# EAGLE design Final project combined (EAGLE 7.6.0)
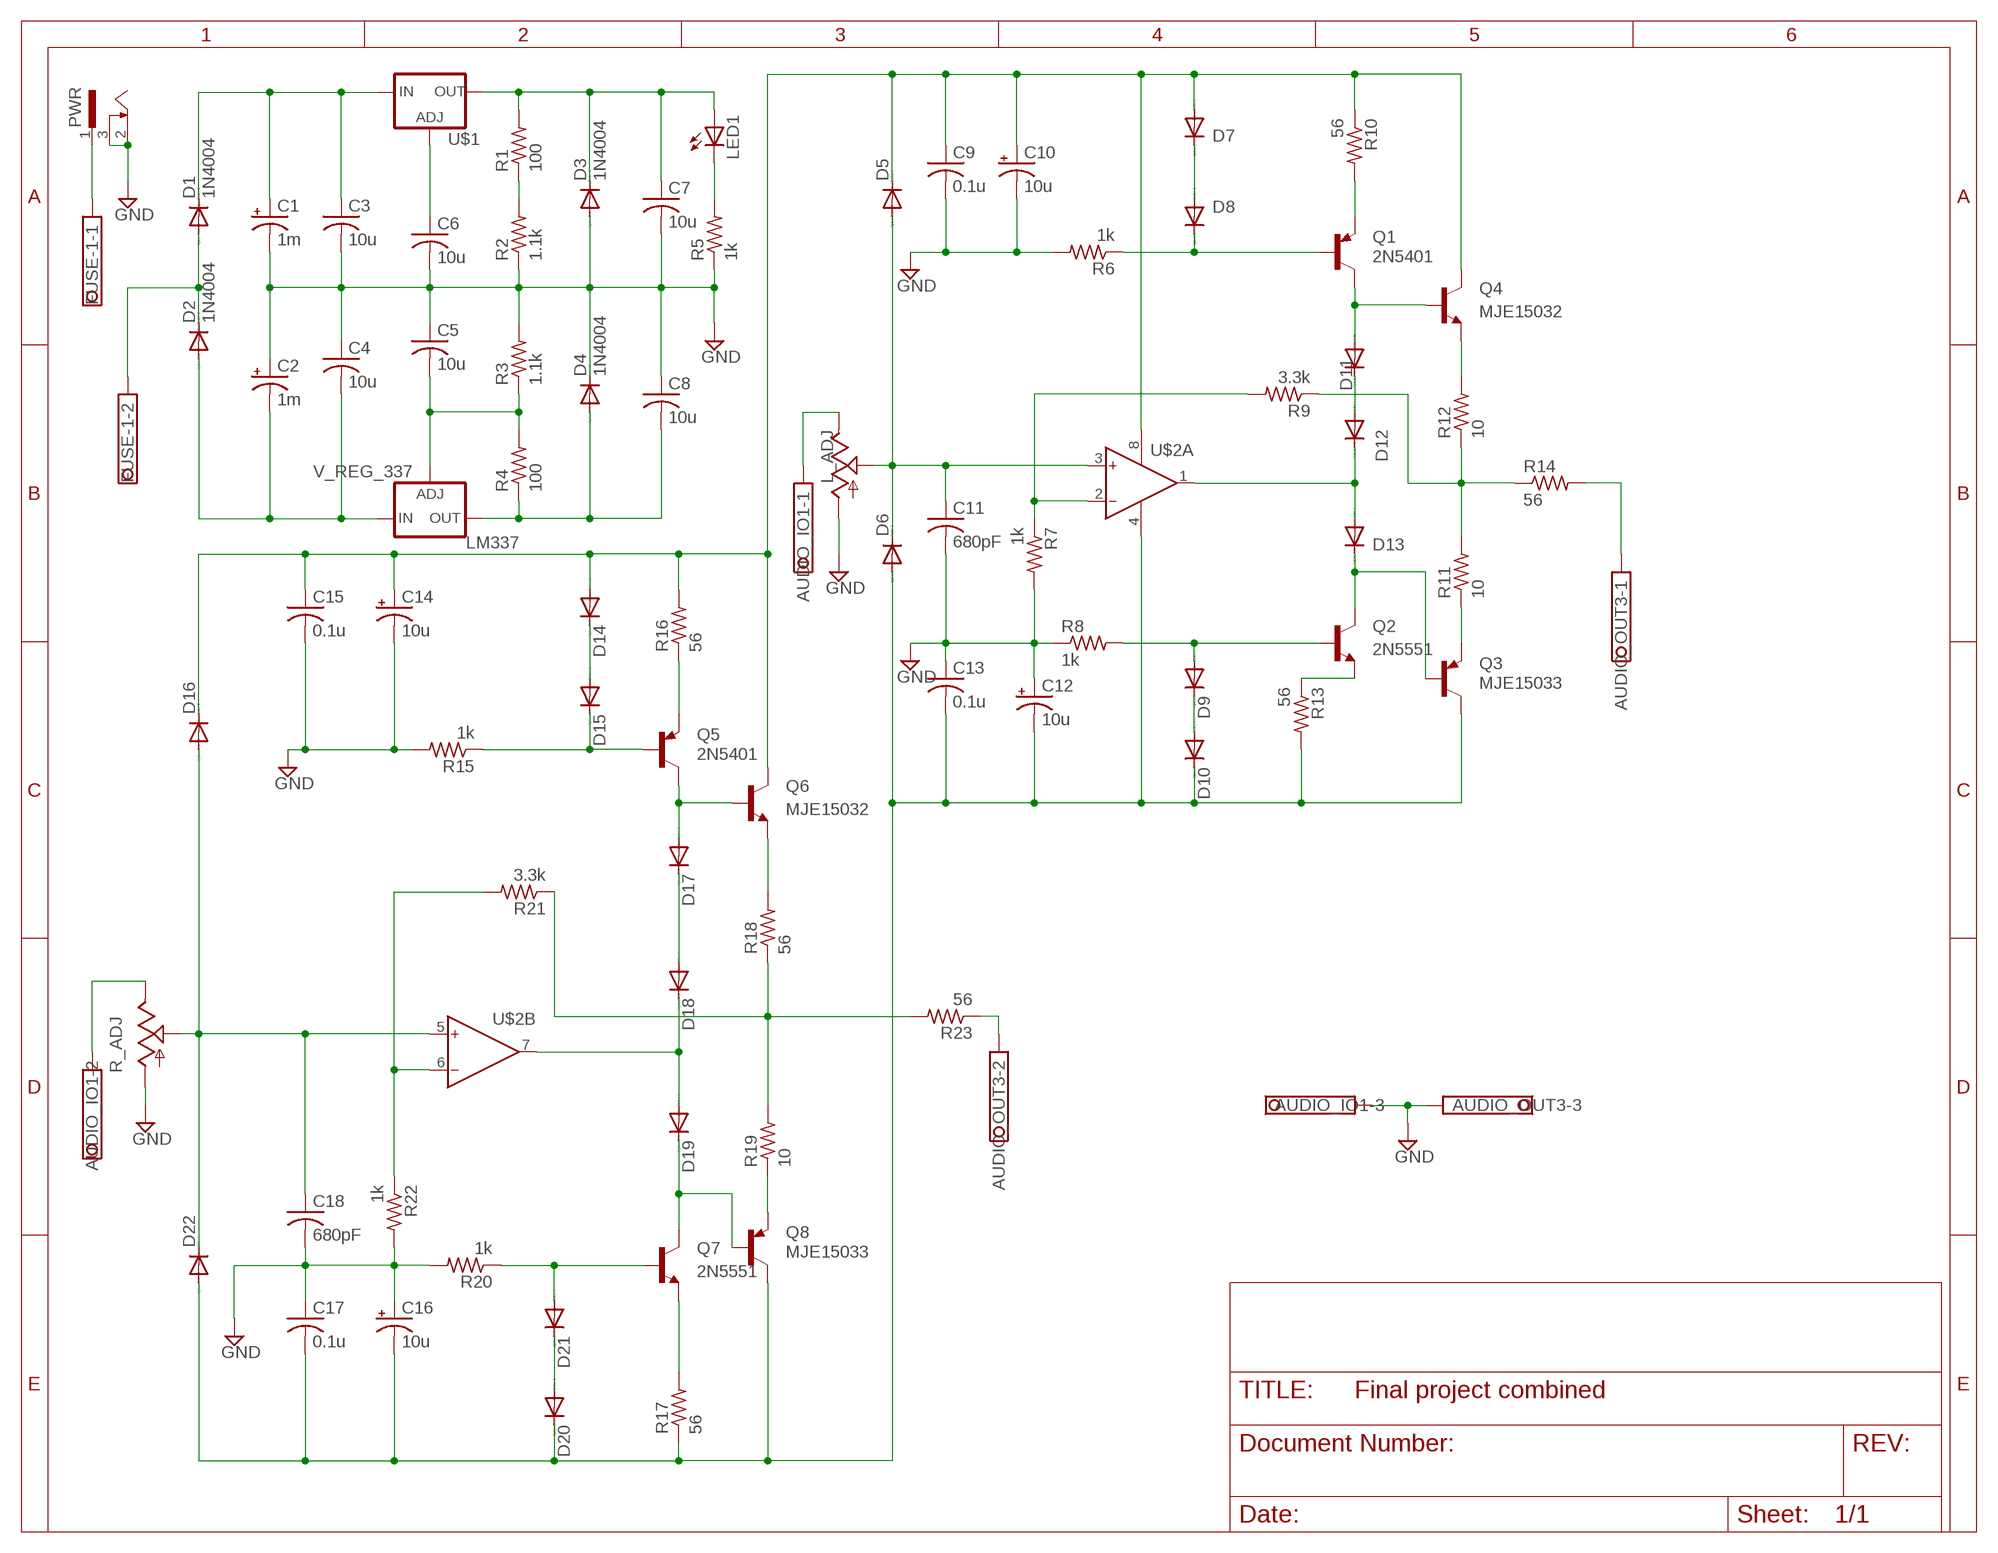
[diagram p0: schematic, sheet 1]

## Parts
AUDIO_IO1  1751251  [1751251]
AUDIO_OUT3  1751251  [1751251]
C1  1m  CPOL-USE2-5  [E2-5]
C2  1m  CPOL-USE2-5  [E2-5]
C3  10u  C-US025-024X044  [C025-024X044]
C4  10u  C-US025-024X044  [C025-024X044]
C5  10u  C-US025-024X044  [C025-024X044]
C6  10u  C-US025-024X044  [C025-024X044]
C7  10u  C-US025-024X044  [C025-024X044]
C8  10u  C-US025-024X044  [C025-024X044]
C9  0.1u  C-US025-024X044  [C025-024X044]
C10  10u  CPOL-USE2-5  [E2-5]
C11  680pF  C-US025-024X044  [C025-024X044]
C12  10u  CPOL-USE2-5  [E2-5]
C13  0.1u  C-US025-024X044  [C025-024X044]
C14  10u  CPOL-USE2-5  [E2-5]
C15  0.1u  C-US025-024X044  [C025-024X044]
C16  10u  CPOL-USE2-5  [E2-5]
C17  0.1u  C-US025-024X044  [C025-024X044]
C18  680pF  C-US025-024X044  [C025-024X044]
D1  1N4004  [DO41-10]
D2  1N4004  [DO41-10]
D3  1N4004  [DO41-10]
D4  1N4004  [DO41-10]
D5  1N4148DO35-7  [DO35-7]
D6  1N4148DO35-7  [DO35-7]
D7  1N4148DO35-7  [DO35-7]
D8  1N4148DO35-7  [DO35-7]
D9  1N4148DO35-7  [DO35-7]
D10  1N4148DO35-7  [DO35-7]
D11  1N4148DO35-7  [DO35-7]
D12  1N4148DO35-7  [DO35-7]
D13  1N4148DO35-7  [DO35-7]
D14  1N4004  [DO41-10]
D15  1N4004  [DO41-10]
D16  1N4004  [DO41-10]
D17  1N4004  [DO41-10]
D18  1N4004  [DO41-10]
D19  1N4004  [DO41-10]
D20  1N4004  [DO41-10]
D21  1N4004  [DO41-10]
D22  1N4004  [DO41-10]
FUSE-1  1751248  [1751248]
L_ADJ  TRIM_US-B64Y  [B64Y]
LED1  LED5MM  [LED5MM]
LM337  V_REG_337  [TO220-ADJ-NEG]
PWR  SCD-014A  [SCD-014-A]
Q1  2N5401  [2N5401]
Q2  2N5551  [2N5551]
Q3  MJE15033  [TO220V]
Q4  MJE15032  [TO220V]
Q5  2N5401  [2N5401]
Q6  MJE15032  [TO220V]
Q7  2N5551  [2N5551]
Q8  MJE15033  [TO220V]
R1  100  R-US_0207/15  [0207/15]
R2  1.1k  R-US_0207/15  [0207/15]
R3  1.1k  R-US_0207/15  [0207/15]
R4  100  R-US_0207/15  [0207/15]
R5  1k  R-US_0207/15  [0207/15]
R6  1k  R-US_0207/15  [0207/15]
R7  1k  R-US_0207/15  [0207/15]
R8  1k  R-US_0207/15  [0207/15]
R9  3.3k  R-US_0207/15  [0207/15]
R10  56  R-US_0207/15  [0207/15]
R11  10  R-US_0207/15  [0207/15]
R12  10  R-US_0207/15  [0207/15]
R13  56  R-US_0207/15  [0207/15]
R14  56  R-US_0207/15  [0207/15]
R15  1k  R-US_0207/15  [0207/15]
R16  56  R-US_0207/15  [0207/15]
R17  56  R-US_0207/15  [0207/15]
R18  56  R-US_0207/15  [0207/15]
R19  10  R-US_0207/15  [0207/15]
R20  1k  R-US_0207/15  [0207/15]
R21  3.3k  R-US_0207/15  [0207/15]
R22  1k  R-US_0207/15  [0207/15]
R23  56  R-US_0207/15  [0207/15]
R_ADJ  TRIM_US-B64Y  [B64Y]
U$1  V_REG_317SINK  [TO220-ADJ]
U$2  OP275'P'  [DIL08]

## Nets
GND: AUDIO_IO1.3 AUDIO_OUT3.3 C1.- C2.+ C3.2 C4.1 C5.1 C6.2 C7.2 C8.1 C9.2 C10.- C11.2 C12.+ C13.1 C14.- C15.2 C16.+ C17.1 C18.2 D3.A D4.C L_ADJ.A PWR.2 PWR.3 R2.1 R3.2 R5.1 R6.2 R7.2 R8.1 R15.2 R20.2 R22.2 R_ADJ.A
N$1: D7.C D8.A
N$2: R1.1 R2.2
N$3: C11.1 D5.A D6.C L_ADJ.S U$2.3(A:IN+)
N$4: D11.A Q1.C Q4.1(B)
N$5: C9.1 C10.+ C14.+ C15.1 D5.C D7.A D14.A D16.C Q4.2(C) Q6.2(C) R10.1 R16.2 U$2.8(PWR:V+)
N$6: D11.C D12.A
N$7: D1.A D2.C FUSE-1.2
N$8: D17.A Q5.C Q6.1(B)
N$9: C2.- C4.2 D2.A LM337.IN
N$10: C1.+ C3.1 D1.C U$1.IN
N$11: D8.C Q1.B R6.1
N$12: R7.1 R9.2 U$2.2(A:IN-)
N$13: D9.A Q2.B R8.2
N$14: D9.C D10.A
N$15: Q2.E R13.1
N$16: D13.C Q2.C Q3.1(B)
N$17: D12.C D13.A U$2.1(A:OUT)
N$18: R9.1 R11.2 R12.1 R14.1
N$19: Q3.3(E) R11.1
N$20: Q4.3(E) R12.2
N$21: C6.1 U$1.ADJ
N$22: Q1.E R10.2
N$23: FUSE-1.1 PWR.1
N$24: D14.C D15.A
N$25: D15.C Q5.B R15.1
N$26: Q5.E R16.1
N$27: Q6.3(E) R18.2
N$28: D17.C D18.A
N$29: Q8.3(E) R19.1
N$30: D19.C Q7.C Q8.1(B)
N$31: D18.C D19.A U$2.7(B:OUT)
N$32: D21.A Q7.B R20.1
N$33: D20.A D21.C
N$34: R18.1 R19.2 R21.1 R23.2
N$35: R21.2 R22.1 U$2.6(B:IN-)
N$36: C18.1 D16.A D22.C R_ADJ.S U$2.5(B:IN+)
N$37: Q7.E R17.2
N$38: AUDIO_IO1.2 R_ADJ.E
N$39: C12.- C13.2 C16.- C17.2 D6.A D10.C D20.C D22.A Q3.2(C) Q8.2(C) R13.2 R17.1 U$2.4(PWR:V-)
N$40: AUDIO_IO1.1 L_ADJ.E
N$41: C8.2 D4.A LM337.OUT R4.1
N$42: C5.2 LM337.ADJ R3.1 R4.2
N$43: LED1.K(C) R5.2
N$44: C7.1 D3.C LED1.A R1.2 U$1.OUT
N$45: AUDIO_OUT3.2 R23.1
N$46: AUDIO_OUT3.1 R14.2

## Library data of the parts
AUDIO_IO1 AUDIO_OUT3 = con-phoenix-350:1751251: MKDS 1/ 3-3,5 Printklemme Nennstrom: 10 A Bemessungsspannung: 160 V Raster: 3,5 mm Polzahl: 3 Montageart: Löten Anschlussart: Schraubanschluss Anschlussrichtung vom Leiter zur Platine: 0° Source: http://eshop.phoenixcontact.com .. 1751251.pdf; OC_FARNELL: unknown; OC_NEWARK: unknown
C1 C2 C10 C12 C14 C16 = rcl:CPOL-US: POLARIZED CAPACITOR, American symbol
C3-C9 C11 C13 C15 C17 C18 = rcl:C-US: CAPACITOR, American symbol
D1-D4 D14-D22 = diode:1N4004: DIODE general purpose rectifier, 1 A
D5-D13 = diode:1N4148: DIODE high speed (Philips)
FUSE-1 = con-phoenix-350:1751248: MKDS 1/ 2-3,5 Printklemme Nennstrom: 10 A Bemessungsspannung: 160 V Raster: 3,5 mm Polzahl: 2 Montageart: Löten Anschlussart: Schraubanschluss Anschlussrichtung vom Leiter zur Platine: 0° Source: http://eshop.phoenixcontact.com .. 1751248.pdf; OC_FARNELL: unknown; OC_NEWARK: unknown
L_ADJ R_ADJ = pot:TRIM_US-: POTENTIOMETER
LED1 = led:LED: LED OSRAM: - CHIPLED LG R971, LG N971, LY N971, LG Q971, LY Q971, LO R971, LY R971 LH N974, LH R974 LS Q976, LO Q976, LY Q976 LO Q996 - Hyper CHIPLED LW Q18S LB Q993, LB Q99A, LB R99A - SideLED LS A670, LO A670, LY A670, LG A670, LP A670 LB A673, LV A673, LT A673, LW A673 LH A674 LY A675 LS A676, LA A676, LO A676, LY A676, LW A676 LS A679, LY A679, LG A679 - Hyper Micro SIDELED® LS Y876, LA Y876, LO Y876, LY Y876 LT Y87S - SmartLED LW L88C, LW L88S LB L89C, LB L89S, LG L890 LS L89K, LO L89K, LY L89K LS L896, LA L896, LO L896, LY L896 - TOPLED LS T670, LO T670, LY T670, LG T670, LP T670 LSG T670, LSP T670, LSY T670, LOP T670, LYG T670 LG T671, LOG T671, LSG T671 LB T673, LV T673, LT T673, LW T673 LH T674 LS T676, LA T676, LO T676, LY T676, LB T676, LH T676, LSB T676, LW T676 LB T67C, LV T67C, LT T67C, LS T67K, LO T67K, LY T67K, LW E67C LS E67B, LA E67B, LO E67B, LY E67B, LB E67C, LV E67C, LT E67C LW T67C LS T679, LY T679, LG T679 LS T770, LO T770, LY T770, LG T770, LP T770 LB T773, LV T773, LT T773, LW T773 LH T774 LS E675, LA E675, LY E675, LS T675 LS T776, LA T776, LO T776, LY T776, LB T776 LHGB T686 LT T68C, LB T68C - Hyper Mini TOPLED® LB M676 - Mini TOPLED Santana® LG M470 LS M47K, LO M47K, LY M47K Source: http://www.osram.convergy.de LUXEON: - LUMILED® LXK2-PW12-R00, LXK2-PW12-S00, LXK2-PW14-U00, LXK2-PW14-V00 LXK2-PM12-R00, LXK2-PM12-S00, LXK2-PM14-U00 LXK2-PE12-Q00, LXK2-PE12-R00, LXK2-PE12-S00, LXK2-PE14-T00, LXK2-PE14-U00 LXK2-PB12-K00, LXK2-PB12-L00, LXK2-PB12-M00, LXK2-PB14-N00, LXK2-PB14-P00, LXK2-PB14-Q00 LXK2-PR12-L00, LXK2-PR12-M00, LXK2-PR14-Q00, LXK2-PR14-R00 LXK2-PD12-Q00, LXK2-PD12-R00, LXK2-PD12-S00 LXK2-PH12-R00, LXK2-PH12-S00 LXK2-PL12-P00, LXK2-PL12-Q00, LXK2-PL12-R00 Source: www.luxeon.com KINGBRIGHT: KA-3528ASYC Source: www.kingbright.com
LM337 = engr301_lib:V_REG_337: LM-337 Negative Adjustable Voltage Regulator
PWR = con-shiua-chyuan:SCD-014A: Power Jack 2.5mm; OC_FARNELL: unknown; OC_NEWARK: unknown
Q1 Q5 = engr301_lib:2N5401
Q2 Q7 = engr301_lib:2N5551
Q3 Q8 = engr301_lib:MJE15033: PNP Power Transistor HF Audio Driver 8.0A, 250V, 50W
Q4 Q6 = engr301_lib:MJE15032: NPN Power Transistor HF Audio Driver 8.0A, 250V, 50W
R1-R23 = rcl:R-US_: RESISTOR, American symbol
U$1 = engr301_lib:V_REG_317: Voltage Regulator Standard LM317 adjustable voltage regulator. AOI (Adjust Output Input). Google 'LM317 Calculator' for easy to use app to get the two resistor values needed. 240/720 for 5V output. 240/390 for 3.3V output. Spark Fun Electronics SKU : COM-00527
U$2 = engr301_lib:OP275: OP275 - Dual Bipolar/JFET Audio Op-amp

## Board
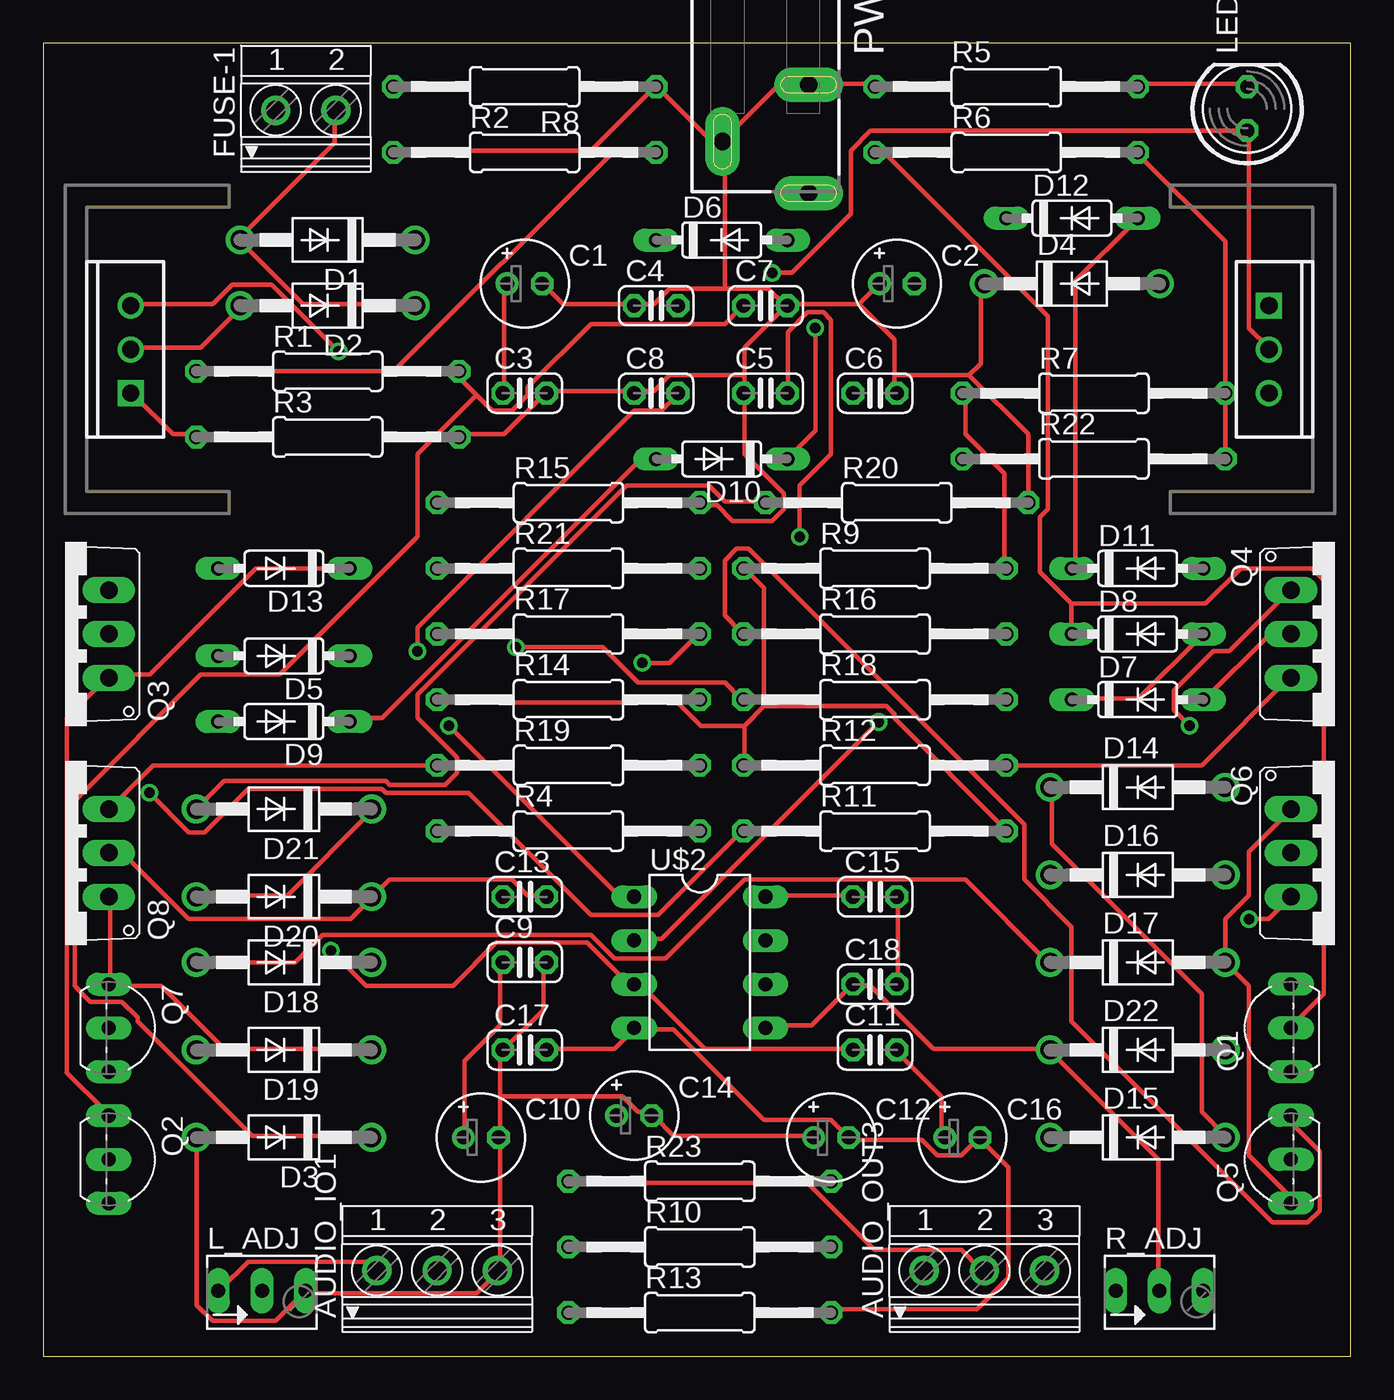
[diagram p1: board, top side]
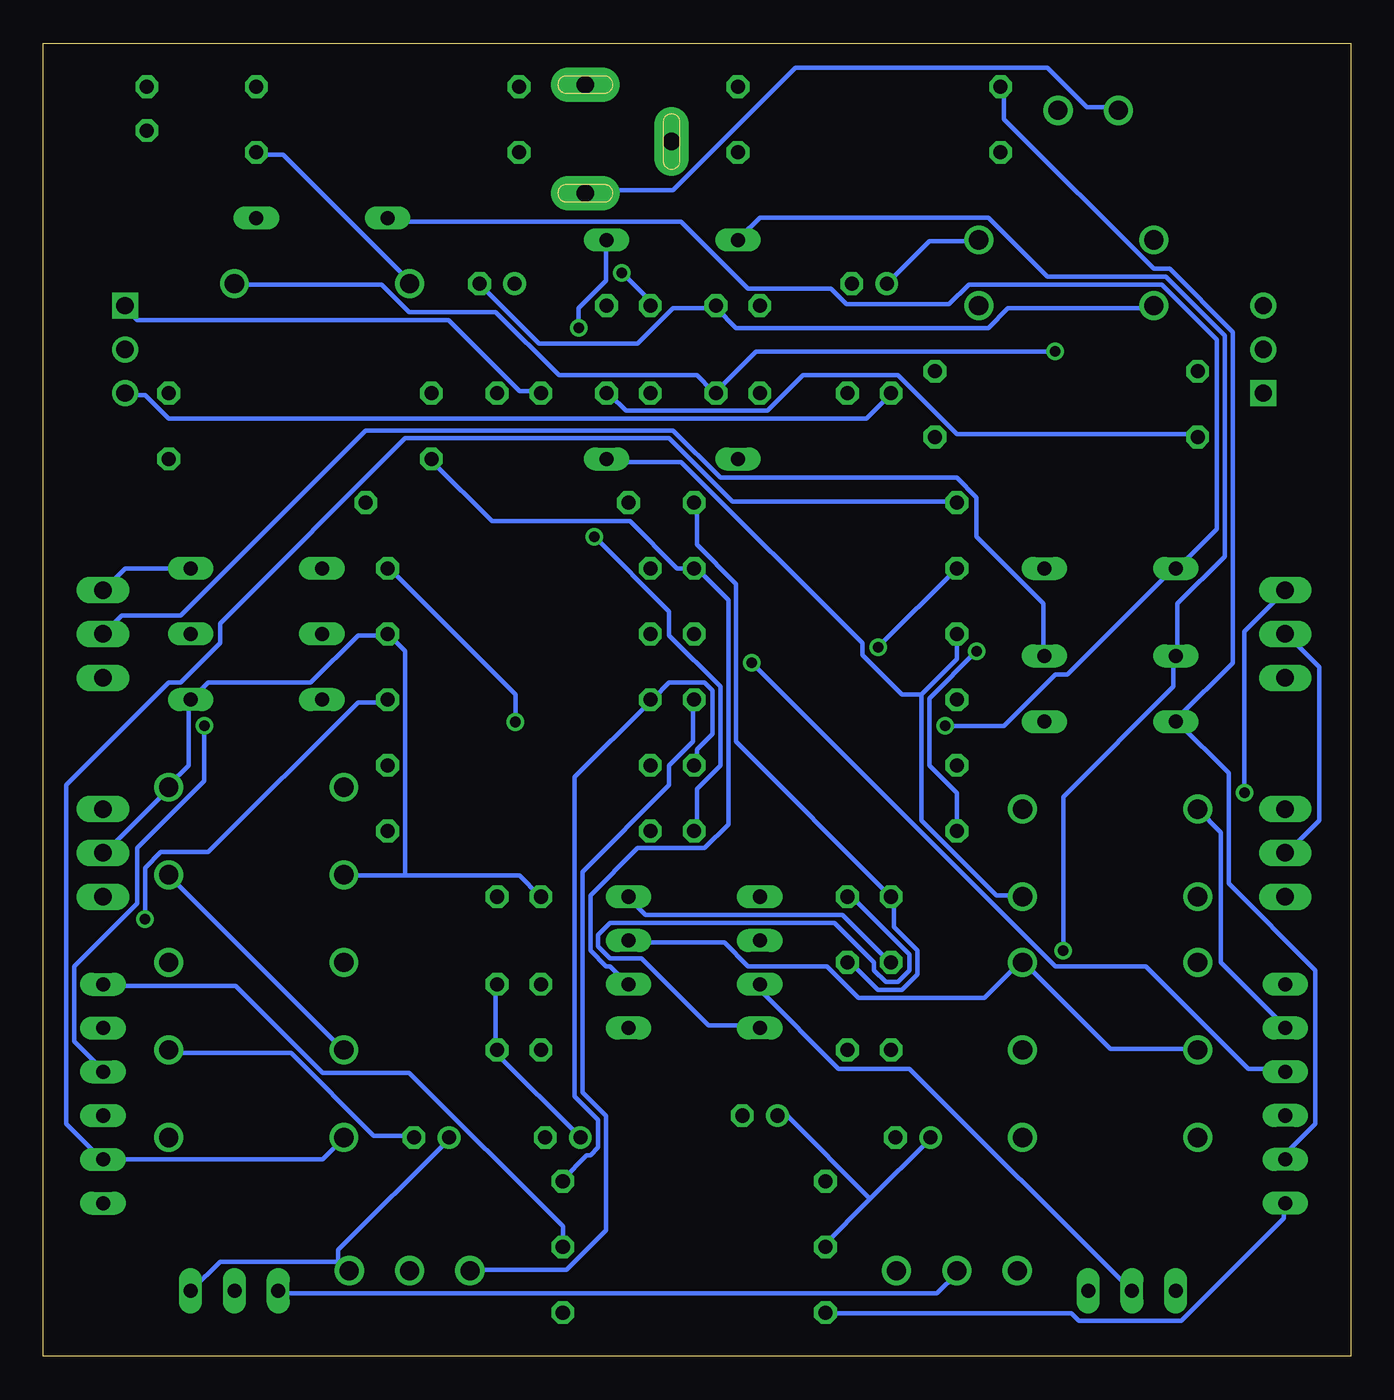
[diagram p2: board, bottom side, seen from below]

Size 75.87 x 76.19 mm. Coordinates in mm from the lower left corner, seen from the top.
Outline: 0,0 75.87,0 75.87,76.19 0,76.19 0,0
Copper layers (1*16): Top 0.035mm / dielectric 1.5mm / Bottom 0.035mm
Design rules "default": minimum track width 10mil, minimum drill 24mil, track to track 8mil, track to pad 8mil, pad to pad 8mil, via to via 8mil, smd to smd 8mil, copper to edge 40mil, drill to drill 8mil, minimum pad ring 10mil, minimum via ring 8mil, stop-mask expansion 4mil, vias tented up to drill 0mil, thermal gap 10mil

### Footprints (pad centres in the part's own frame; a part is rotated, then mirrored left to right if it is on the bottom)
1751251 = drill 1.1 pad 1.7: 1 -3.5,-0.1; 2 0,-0.1; 3 3.5,-0.1
E2-5 = drill 0.813 pad 1.27: + -1.016,0 | drill 0.813 pad 1.27 octagon: - 1.016,0
C025-024X044 = drill 0.813 octagon: 1 -1.27,0; 2 1.27,0
DO41-10 = drill 1.118: A 5.08,0; C -5.08,0
DO35-7 = drill 0.813 long: A 3.81,0; C -3.81,0
1751248 = drill 1.1 pad 1.7: 1 -1.75,-0.1; 2 1.75,-0.1
B64Y = drill 0.813 long: A 2.54,0; E -2.54,0; S 0,0
LED5MM = drill 0.813 octagon: A -1.27,0; K 1.27,0
TO220-ADJ-NEG = drill 1 square: ADJ -2.54,0 | drill 1: IN 0,0; OUT 2.54,0
SCD-014-A = drill 1 pad 2 long: 1 -2.5,13.8; 2 -2.5,7.5; 3 2.5,10.8
2N5401 = drill 0.813 long: B 0,0; C -2.54,0; E 2.54,0
2N5551 = drill 0.813 long: B 0,0; C -2.54,0; E 2.54,0
TO220V = drill 1.016 long: 1 -2.54,-2.54; 2 0,-2.54; 3 2.54,-2.54
0207/15 = drill 0.813 octagon: 1 -7.62,0; 2 7.62,0
TO220-ADJ = drill 1 square: ADJ -2.54,0 | drill 1: IN 2.54,0; OUT 0,0
DIL08 = drill 0.813 long: 1 -3.81,-3.81; 2 -1.27,-3.81; 3 1.27,-3.81; 4 3.81,-3.81; 5 3.81,3.81; 6 1.27,3.81; 7 -1.27,3.81; 8 -3.81,3.81

### Placement (x,y rotation side)
AUDIO_IO1  22.86,5.08 0 top
AUDIO_OUT3  54.61,5.08 0 top
C1  27.94,62.23 0 top
C2  49.53,62.23 0 top
C3  27.94,55.88 0 top
C4  35.56,60.96 0 top
C5  41.91,55.88 0 top
C6  48.26,55.88 0 top
C7  41.91,60.96 0 top
C8  35.56,55.88 0 top
C9  27.94,22.86 0 top
C10  25.4,12.7 0 top
C11  48.26,17.78 0 top
C12  45.72,12.7 0 top
C13  27.94,26.67 0 top
C14  34.29,13.97 0 top
C15  48.26,26.67 0 top
C16  53.34,12.7 0 top
C17  27.94,17.78 0 top
C18  48.26,21.59 0 top
D1  16.51,64.77 180 top
D2  16.51,60.96 180 top
D3  13.97,12.7 180 top
D4  59.69,62.23 0 top
D5  13.97,40.64 180 top
D6  39.37,64.77 0 top
D7  63.5,38.1 0 top
D8  63.5,41.91 0 top
D9  13.97,36.83 180 top
D10  39.37,52.07 180 top
D11  63.5,45.72 0 top
D12  59.69,66.04 0 top
D13  13.97,45.72 180 top
D14  63.5,33.02 0 top
D15  63.5,12.7 0 top
D16  63.5,27.94 0 top
D17  63.5,22.86 0 top
D18  13.97,22.86 180 top
D19  13.97,17.78 180 top
D20  13.97,26.67 180 top
D21  13.97,31.75 180 top
D22  63.5,17.78 0 top
FUSE-1  15.24,72.39 0 top
L_ADJ  12.7,3.81 0 top
LED1  69.85,72.39 90 top
LM337  5.08,58.42 90 top
PWR  41.91,81.28 180 top
Q1  72.39,19.05 90 top
Q2  3.81,11.43 270 top
Q3  1.27,41.91 90 top
Q4  74.93,41.91 270 top
Q5  72.39,11.43 90 top
Q6  74.93,29.21 270 top
Q7  3.81,19.05 270 top
Q8  1.27,29.21 90 top
R1  16.51,57.15 0 top
R2  27.94,69.85 0 top
R3  16.51,53.34 0 top
R4  30.48,30.48 0 top
R5  55.88,73.66 0 top
R6  55.88,69.85 0 top
R7  60.96,55.88 0 top
R8  27.94,73.66 180 top
R9  48.26,45.72 0 top
R10  38.1,6.35 0 top
R11  48.26,30.48 0 top
R12  48.26,34.29 0 top
R13  38.1,2.54 0 top
R14  30.48,38.1 0 top
R15  30.48,49.53 0 top
R16  48.26,41.91 0 top
R17  30.48,41.91 0 top
R18  48.26,38.1 0 top
R19  30.48,34.29 0 top
R20  49.53,49.53 0 top
R21  30.48,45.72 0 top
R22  60.96,52.07 0 top
R23  38.1,10.16 0 top
R_ADJ  64.77,3.81 0 top
U$1  71.12,58.42 270 top
U$2  38.1,22.86 270 top

### Tracks (layer width: path | path; a pad name or v marks a point on that pad's centre or on a via)
GND
  Top 0.254: R5.1 48.23,73.84 44.58,73.84 PWR.2 44.35,73.61 42.52,73.61 39.55,70.64 PWR.3 | R2.1 20.34,69.95 31.77,69.95 35.43,73.61 R8.1 35.66,73.61 38.63,70.64 39.32,70.64 PWR.3 | R22.2 R7.2 68.58,64.69 63.55,69.72 R6.2 | R3.2 24.23,53.49 26.75,53.49 29.03,55.78 C3.2 29.26,56.01 34.29,56.01 | R15.2 38.18,49.38 39.09,49.38 40.01,48.46 42.29,48.46 42.98,49.15 42.98,50.06 40.69,52.35 40.69,55.78 C5.1 40.69,56.01 40.69,56.92 | 34.29,61.04 30.18,61.04 29.03,62.18 C1.- | 47.32,61.04 43.2,61.04 C7.2 | C2.+ 47.32,61.04 | 49.38,56.92 49.38,58.98 47.32,61.04 | 49.38,56.92 49.38,56.01 C6.2 | R20.2 57.15,53.49 53.72,56.92 | 49.38,56.92 53.72,56.92 | 34.29,61.04 35.43,61.04 36.35,61.95 39.55,61.95 | 39.55,61.95 42.06,61.95 42.98,61.04 C7.2 | 34.29,61.04 C4.1 | 40.69,56.92 40.69,58.52 42.98,60.81 C7.2 | 34.29,56.01 35.43,56.01 36.35,56.92 40.69,56.92 | 34.29,56.01 C8.1 | 53.72,56.92 54.41,57.61 54.41,62.18 D4.C | 39.55,61.95 39.55,70.41 PWR.3 | C15.2 49.61,26.52 49.61,21.72 C18.2 | C16.+ 52.12,12.8 52.12,15.09 49.61,17.6 C11.2 | 26.52,15.09 26.52,17.6 C17.1 26.75,17.83 29.03,20.12 29.03,22.86 C9.2 | 26.52,15.09 26.52,12.8 C10.- 26.52,12.57 26.52,5.03 AUDIO_IO1.3 26.29,4.8 25.15,3.66 15.32,3.66 L_ADJ.A 13.49,2.06 9.83,2.06 8.91,2.97 8.91,12.57 D3.A | 26.52,15.09 33.6,15.09 34.52,14.17 35.2,14.17 C14.- 35.43,13.95 36.58,12.8 44.58,12.8 C12.+
  Bottom 0.254: R6.2 63.32,69.72 61.95,69.72 54.63,62.41 D4.C | 58.75,5.49 65.61,5.49 67.21,3.89 R_ADJ.A | 58.75,5.49 58.29,5.03 AUDIO_OUT3.3 58.75,5.49 | C12.+ 49.61,17.6 C11.2 49.61,17.83 49.61,21.49 C18.2 | 58.75,5.49 58.75,6.17 52.35,12.57 C16.+ | C9.2 29.03,22.86 27.43,21.26 26.06,21.26 25.15,22.17 25.15,23.55 26.52,24.92 26.52,26.52 C13.1 35.66,35.66 35.66,44.81 37.95,47.09 37.95,49.38 R15.2
N$1
  Top 0.254: D7.C 59.89,38.18 63.55,38.18 67.21,41.83 D8.A
N$2
  Top 0.254: R1.1 20.34,57.15 32.92,69.72 35.43,69.72 R2.2
N$3  (via drill 0.61)
  Top 0.254: C11.1 46.86,17.83 38.41,17.83 34.75,21.49 34.29,21.49 U$2.3 34.29,21.72 33.83,21.72 31.55,24 26.29,24 23.77,21.49 18.75,21.49 v16.69,23.55
  Bottom 0.254: D6.C 35.43,64.92 34.29,66.06 21.03,66.06 17.6,62.64 10.74,62.64 7.32,59.21 7.32,46.41 10.06,43.66 10.06,40.69 D5.A 10.29,40.46 10.29,38.86 16.69,32.46 v16.69,23.55 | U$2.3 34.29,21.26 29.72,16.69 25.6,16.69 12.8,3.89 L_ADJ.S
N$4  (via drill 0.61)
  Top 0.254: v66.52,36.58 65.61,37.49 65.61,38.63 67.89,40.92 68.81,40.92 72.24,44.35 Q4.1
  Bottom 0.254: D11.A 71.09,45.72 72.24,44.58 Q4.1 | v66.52,36.58 66.52,33.38 70.41,29.49 70.41,26.29 74.07,22.63 74.07,18.29 72.47,16.69 Q1.C
N$5
  Top 0.254: C9.1 26.52,22.86 26.52,19.2 24.46,17.14 24.46,12.8 C10.+ | U$2.8 42.06,26.75 46.86,26.75 C15.1 | Q4.2 72.24,41.83 71.09,41.83 67.44,38.18 D7.A
  Bottom 0.254: Q4.2 71.32,42.98 67.89,42.98 57.15,53.72 39.32,53.72 36.58,50.98 22.86,50.98 21.72,49.84 21.72,47.55 17.83,43.66 17.83,40.69 D5.C | 27.89,9.14 30.63,6.4 R10.1 | 27.89,9.14 24.46,12.57 C10.+ | 27.89,9.14 32.69,13.95 33.15,13.95 C14.+ | 54.86,27.89 48.23,27.89 47.09,26.75 C15.1 | 54.86,27.89 58.29,27.89 D16.C | Q6.2 72.24,29.26 68.58,32.92 D14.A 68.58,33.15 67.44,34.29 67.44,37.95 D7.A 67.21,38.18 66.29,39.09 60.35,39.09 57.61,41.83 56.01,41.83 R16.2 55.78,41.83 54.86,40.92 54.86,27.89 | C9.1 26.75,22.86 29.49,25.6 40.92,25.6 41.83,26.52 U$2.8
N$6
  Top 0.254: D11.C 59.89,45.72 59.89,62.41 63.32,65.84 D12.A
N$7
  Top 0.254: D2.C 21.49,61.04 15.09,61.04 11.43,64.69 D1.A 11.43,64.92 16.92,70.41 16.92,72.24 FUSE-1.2
N$8
  Top 0.254: Q5.C 72.24,8.91 72.24,9.37 69.95,11.66 69.95,21.49 D17.A 68.58,25.38 69.95,26.75 69.95,29.26 72.24,31.55 Q6.1
N$9
  Top 0.254: LM337.IN 5.26,58.52 9.14,58.52 11.43,60.81 D2.A
  Bottom 0.254: C2.- 50.52,62.18 47.09,58.75 41.38,58.75 39.32,60.81 37.03,60.81 C4.2 36.8,60.81 35.66,59.66 21.03,59.66 19.89,60.81 11.43,60.81 D2.A
N$10
  Top 0.254: C3.1 26.75,56.01 26.75,62.18 C1.+
  Bottom 0.254: U$1.IN 71.09,55.78 69.95,55.78 68.58,54.41 28.12,54.41 26.75,55.78 C3.1 | C1.+ 24.46,64.69 21.72,64.69 D1.C
N$11
  Top 0.254: 59.66,43.66 59.66,42.06 D8.C | 59.66,43.66 57.84,45.49 57.84,48.69 58.29,49.15 58.29,60.35 48.92,69.72 48.46,69.72 R6.1 | 59.66,43.66 67.44,43.66 69.49,45.72 73.61,45.72 74.3,45.03 74.3,21.03 72.47,19.2 Q1.B
N$12  (via drill 0.61)
  Top 0.254: v48.46,36.8 35.89,24.23 34.29,24.23 U$2.2 | R7.1 53.49,55.78 53.49,53.49 55.78,51.21 55.78,45.72 R9.2
  Bottom 0.254: v48.46,36.8 48.46,38.41 55.78,45.72 R9.2
N$13
  Bottom 0.254: Q2.B 3.66,11.43 3.66,11.89 2.06,13.49 2.06,22.4 7.09,27.43 7.09,33.83 10.06,36.8 D9.A 10.06,37.03 6.86,40.23 6.86,59.44 10.52,63.09 11.43,63.09 20.12,71.78 20.12,73.61 R8.2
N$14
  Top 0.254: D9.C 17.83,37.03 19.66,37.03 34.52,51.89 35.43,51.89 D10.A
N$15
  Bottom 0.254: R13.1 30.4,2.52 16.23,2.52 15.77,2.06 9.83,2.06 3.89,8 3.89,8.69 Q2.E
N$16
  Top 0.254: Q2.C 3.66,14.17 1.37,16.46 1.37,37.03 3.66,39.32 Q3.1 3.89,39.55 6.17,39.55 12.34,45.72 D13.C
N$17  (via drill 0.61)
  Top 0.254: v23.55,36.58 33.38,26.75 34.29,26.75 U$2.1
  Bottom 0.254: v23.55,36.58 20.12,36.58 17.14,39.55 16.46,39.55 10.29,45.72 D13.A 10.06,45.72 7.77,48.01 7.77,58.98 10.97,62.18 22.17,62.18 23.32,61.04 29.26,61.04 30.18,61.95 34.98,61.95 38.86,65.84 55.78,65.84 D12.C
N$18
  Top 0.254: 40.69,36.58 40.69,34.29 R12.1 | 41.83,37.72 40.69,36.58 | 41.83,37.72 41.83,44.58 40.69,45.72 R9.1 | 41.83,37.72 48.92,37.72 49.38,37.26 49.38,37.03 55.78,30.63 R11.2 | 40.69,36.58 38.18,36.58 36.8,37.95 22.86,37.95 R14.1
N$19  (via drill 0.61)
  Top 0.254: v6.17,32.69 8.46,30.4 9.37,30.4 11.89,32.92 19.66,32.92 19.89,32.69 24.69,32.69 31.77,25.6 35.66,25.6 40.46,30.4 R11.1
  Bottom 0.254: v6.17,32.69 6.17,42.06 3.89,44.35 Q3.3
N$20
  Top 0.254: R12.2 67.21,34.29 72.24,39.32 Q4.3
N$21
  Bottom 0.254: C6.1 47.09,56.01 48.23,56.01 52.35,60.12 70.41,60.12 71.09,60.81 U$1.ADJ
N$22
  Bottom 0.254: R10.2 45.72,7.54 54.63,16.46 59.66,16.46 64.69,21.49 72.24,21.49 Q1.E
N$23
  Bottom 0.254: FUSE-1.1 13.72,72.47 15.32,72.47 17.6,74.75 32.23,74.75 39.32,67.67 44.35,67.67 PWR.1
N$24
  Top 0.254: D14.C 58.52,32.92 58.52,29.72 67.21,21.03 67.21,14.17 68.58,12.8 D15.A
N$25
  Bottom 0.254: D15.C 58.52,12.57 59.66,11.43 Q5.B 72.47,11.43 74.52,13.49 74.52,33.15 68.58,39.09 67.89,39.09 65.61,41.38 65.61,42.52 54.86,53.26 39.55,53.26 35.89,49.61 22.86,49.61 R15.1
N$26
  Top 0.254: Q5.E 72.47,13.95 72.47,13.49 74.07,11.89 74.07,8.46 73.38,7.77 71.32,7.77 59.66,19.43 59.66,24.92 56.92,27.66 56.92,30.86 40.92,46.86 40.23,46.86 39.55,46.18 39.55,42.98 40.46,42.06 R16.1
N$27  (via drill 0.61)
  Top 0.254: v69.95,25.38 71.09,25.38 Q6.3
  Bottom 0.254: v69.95,25.38 69.95,28.35 69.04,29.26 66.29,29.26 57.61,37.95 56.01,37.95 R18.2
N$28
  Top 0.254: D18.A 14.63,22.86 16.23,24.46 31.77,24.46 33.15,23.09 36.12,23.09 40.69,27.66 53.49,27.66 58.29,22.86 D17.C
N$29
  Top 0.254: R19.1 6.4,34.29 3.89,31.77 Q8.3
N$30
  Top 0.254: Q8.1 3.89,26.52 3.89,21.72 Q7.C 3.89,21.49 6.86,21.49 10.52,17.83 18.97,17.83 D19.C
N$31
  Bottom 0.254: U$2.7 41.83,24 36.35,24 34.98,22.63 30.4,22.63 28.57,20.8 21.26,20.8 19.2,22.86 D18.C 18.97,22.86 13.95,17.83 8.91,17.83 D19.A
N$32
  Top 0.254: D21.A 10.52,33.38 19.89,33.38 20.12,33.15 23.32,33.15 24,33.83 24,34.75 21.72,37.03 21.72,38.41 33.83,50.52 38.63,50.52 39.55,49.61 41.83,49.61 R20.1
  Bottom 0.254: D21.A 7.54,30.4 7.54,22.86 3.89,19.2 Q7.B
N$33
  Top 0.254: D20.A 8.91,26.75 14.17,26.75 18.97,31.55 D21.C
N$34  (via drill 0.61)
  Top 0.254: v27.43,41.15 32.46,41.15 34.52,39.09 39.55,39.09 40.46,38.18 R18.1
  Bottom 0.254: R23.2 45.72,10.29 44.35,11.66 44.12,11.66 43.66,12.12 43.66,13.72 45.03,15.09 45.03,33.6 40.69,37.95 R18.1 40.46,38.18 39.55,39.09 37.49,39.09 37.03,38.63 37.03,36.12 37.95,35.2 37.95,34.29 R19.2 | v27.43,41.15 R21.1
N$35
  Bottom 0.254: R22.1 53.26,51.89 49.84,48.46 41.83,48.46 39.09,45.72 R21.2 37.95,45.72 36.12,43.89 36.12,30.86 37.49,29.49 41.38,29.49 44.12,26.75 44.12,23.55 43.2,22.63 42.98,22.63 42.06,21.72 U$2.6
N$36
  Top 0.254: U$2.5 42.06,19.2 44.58,19.2 46.86,21.49 C18.1 47.09,21.49 48.01,21.49 51.66,17.83 58.29,17.83 D22.C 58.52,17.6 64.69,11.43 64.69,3.89 R_ADJ.S
  Bottom 0.254: D16.A 68.58,27.89 58.52,17.83 D22.C
N$37  (via drill 0.61)
  Top 0.254: v34.75,40.23 36.35,40.23 37.95,41.83 R17.2
  Bottom 0.254: v34.75,40.23 17.14,22.63 11.89,22.63 5.94,16.69 3.89,16.69 Q7.E
N$38
  Bottom 0.254: R_ADJ.E 62.18,3.66 24,3.66 22.86,4.8 AUDIO_IO1.2
N$39  (via drill 0.61)
  Top 0.254: 34.29,18.97 33.15,17.83 29.26,17.83 C17.2 | R13.2 45.72,2.74 54.18,2.74 56.01,4.57 56.01,10.97 54.41,12.57 C16.- 54.18,12.57 53.26,11.66 51.89,11.66 50.98,12.57 46.86,12.57 C12.- 45.72,13.72 41.83,13.72 36.58,18.97 34.29,18.97 | 34.29,18.97 U$2.4 | C13.2 29.03,26.75 28.12,26.75 27.2,27.66 20.12,27.66 19.2,26.75 D20.C 18.97,26.52 17.83,25.38 8.46,25.38 4.8,29.03 3.89,29.03 Q8.2 | v44.81,59.66 44.81,53.72 43.2,52.12 D10.C
  Bottom 0.254: D22.A 68.58,17.6 61.49,17.6 56.69,12.8 54.41,12.8 C16.- | Q8.2 3.66,29.26 1.83,31.09 1.83,40.01 3.66,41.83 Q3.2 | R17.1 22.86,40.46 24.92,38.41 | 24.92,38.41 24.92,31.09 20.57,26.75 19.2,26.75 D20.C | 24.92,38.41 26.06,38.41 28.35,40.69 28.35,41.38 38.86,51.89 42.98,51.89 D10.C | v44.81,59.66 44.81,60.81 43.2,62.41 43.2,64.69 D6.A | U$2.4 34.29,19.2 37.26,19.2 41.15,23.09 42.98,23.09 43.66,23.77 43.66,24.46 42.98,25.15 29.95,25.15 27.66,22.86 27.66,22.4 26.98,21.72 26.29,21.72 25.6,22.4 25.6,23.32 29.03,26.75 C13.2
N$40
  Top 0.254: L_ADJ.E 10.29,3.89 11.89,5.49 18.75,5.49 19.2,5.03 AUDIO_IO1.1
N$41  (via drill 0.61)
  Top 0.254: v21.72,40.92 21.72,42.29 34.29,54.86 35.89,54.86 36.8,55.78 C8.2 | v17.14,58.29 13.26,62.18 10.97,62.18 9.83,61.04 5.26,61.04 LM337.OUT
  Bottom 0.254: R4.1 22.86,32.69 24.46,34.29 24.46,38.18 v21.72,40.92 | v17.14,58.29 34.52,58.29 36.8,56.01 C8.2 37.03,56.01 37.95,56.92 45.95,56.92 49.61,60.58 54.63,60.58 56.24,62.18 64.69,62.18 D4.A
N$42  (via drill 0.61)
  Top 0.254: R3.1 8.69,53.49 7.54,53.49 5.26,55.78 LM337.ADJ | v43.89,47.55 43.89,50.52 45.72,52.35 45.72,60.12 45.26,60.58 44.35,60.58 43.2,59.44 43.2,56.01 C5.2
  Bottom 0.254: v43.89,47.55 39.55,43.2 39.55,41.83 36.58,38.86 36.58,34.29 37.95,32.92 37.95,30.63 R4.2 | R3.1 8.91,53.49 22.86,53.49 26.29,56.92 31.77,56.92 33.83,54.86 42.06,54.86 42.98,55.78 C5.2
N$43
  Top 0.254: R5.2 63.55,73.84 69.72,73.84 LED1.K
N$44  (via drill 0.61)
  Top 0.254: U$1.OUT 71.09,58.52 69.95,59.66 69.95,71.09 LED1.A 69.72,71.09 48.01,71.09 46.86,69.95 46.86,66.29 43.43,62.87 v42.29,62.87 | 25.15,55.78 26.06,54.86 27.2,54.86 28.12,55.78 28.12,56.24 31.77,59.89 39.55,59.89 40.46,60.81 C7.1 | 25.15,55.78 24.23,56.69 24.23,57.15 R1.2 | 25.15,55.78 21.72,52.35 21.72,47.55 13.72,39.55 9.14,39.55 1.83,32.23 1.83,21.49 2.74,20.57 4.57,20.57 5.49,19.66 5.49,19.43 12.12,12.8 18.97,12.8 D3.C
  Bottom 0.254: v42.29,62.87 40.46,61.04 C7.1
N$45
  Top 0.254: R23.1 30.63,10.06 44.35,10.06 48.23,6.17 53.26,6.17 54.41,5.03 AUDIO_OUT3.2
N$46
  Bottom 0.254: R14.2 38.18,37.95 38.18,35.66 39.55,34.29 39.55,33.15 44.58,28.12 44.58,15.32 43.2,13.95 43.2,7.32 45.49,5.03 50.98,5.03 AUDIO_OUT3.1